# EAGLE design derploadxp (EAGLE 6.4)
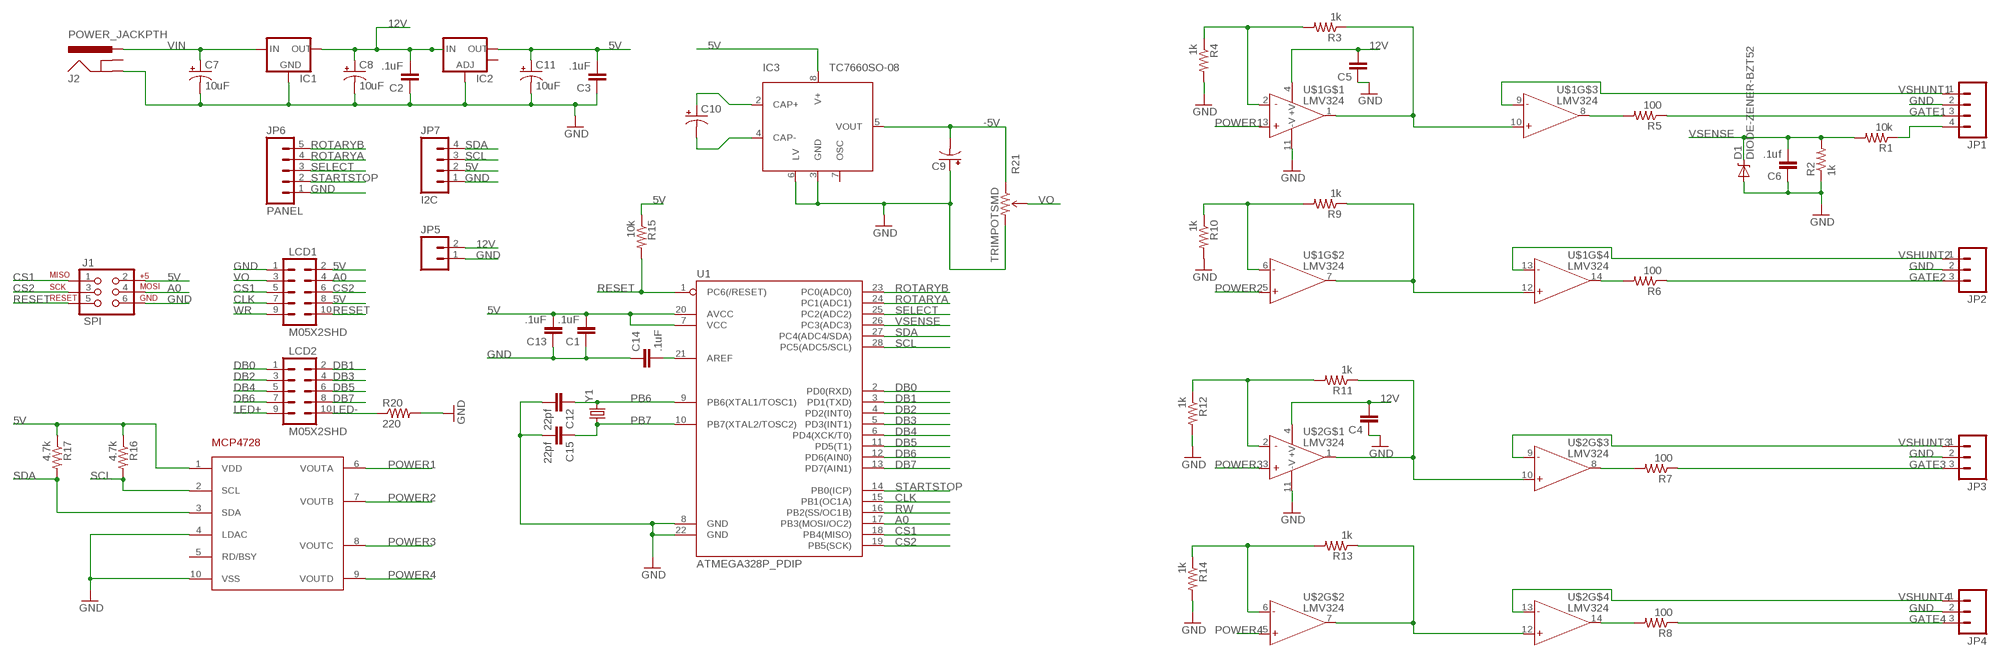
[diagram p0: schematic, sheet 1]

## Parts
C1  .1uF  CAP0805  [0805]
C2  .1uF  CAP0805  [0805]
C3  .1uF  CAP0805  [0805]
C4  CAP0805  [0805]
C5  CAP0805  [0805]
C6  .1uf  CAP0805  [0805]
C7  10uF  CAP_POLC  [PANASONIC_C]
C8  10uF  CAP_POLC  [PANASONIC_C]
C9  CAP_POLC  [PANASONIC_C]
C10  CAP_POLC  [PANASONIC_C]
C11  10uF  CAP_POLC  [PANASONIC_C]
C12  22pf  CAP0805  [0805]
C13  .1uF  CAP0805  [0805]
C14  .1uF  CAP0805  [0805]
C15  22pf  CAP0805  [0805]
D1  DIODE-ZENER-BZT52  [SOD-323]
IC1  V_REG_78XXSINK  [TO220-IGO]
IC2  V_REG_LM1117SOT223  [SOT223]
IC3  TC7660SO-08  [SO-08]
J1  SPI  AVR_SPI_PRG_6NS  [2X3-NS]
J2  POWER_JACKPTH  [POWER_JACK_PTH]
JP1  M04LOCK  [1X04_LOCK]
JP2  M03LOCK  [1X03_LOCK]
JP3  M03LOCK  [1X03_LOCK]
JP4  M03LOCK  [1X03_LOCK]
JP5  M02LOCK  [1X02_LOCK]
JP6  PANEL  M05LOCK  [1X05_LOCK]
JP7  I2C  M04LOCK  [1X04_LOCK]
LCD1  M05X2SHD  [2X5-SHROUDED]
LCD2  M05X2SHD  [2X5-SHROUDED]
R1  10k  RESISTOR0805-RES  [0805]
R2  1k  RESISTOR0805-RES  [0805]
R3  1k  RESISTOR0805-RES  [0805]
R4  1k  RESISTOR0805-RES  [0805]
R5  100  RESISTOR0805-RES  [0805]
R6  100  RESISTOR0805-RES  [0805]
R7  100  RESISTOR0805-RES  [0805]
R8  100  RESISTOR0805-RES  [0805]
R9  1k  RESISTOR0805-RES  [0805]
R10  1k  RESISTOR0805-RES  [0805]
R11  1k  RESISTOR0805-RES  [0805]
R12  1k  RESISTOR0805-RES  [0805]
R13  1k  RESISTOR0805-RES  [0805]
R14  1k  RESISTOR0805-RES  [0805]
R15  10k  RESISTOR0805-RES  [0805]
R16  4.7k  RESISTOR0805-RES  [0805]
R17  4.7k  RESISTOR0805-RES  [0805]
R20  220  RESISTOR0805-RES  [0805]
R21  TRIMPOTSMD  [TRIMPOT-3MM]
U1  ATMEGA328P_PDIP  [DIL28-3]
U$1  LMV324  [SO014]
U$2  LMV324  [SO014]
U$4  MCP4728  [MSOP10]
Y1  CRYSTALSMD  [HC49UP]

## Nets
5V: C1.2 C3.2 C11.+ C13.2 IC2.2(OUT) IC3.8(V+) J1.2 JP7.2 LCD1.2 LCD1.8 R15.1 R16.1 R17.1 U1.7(VCC) U1.20(AVCC) U$4.1(VDD)
12V: C2.2 C4.2 C5.2 C8.+ IC1.OUT IC2.3(IN) JP5.2 U$1.4(+V) U$2.4(+V)
-5V: C9.- IC3.5(VOUT) R21.1(CCW)
A0: J1.4 LCD1.4 U1.17(PB3(MOSI/OC2))
CLK: LCD1.7 U1.15(PB1(OC1A))
CS1: J1.1 LCD1.5 U1.18(PB4(MISO))
CS2: J1.3 LCD1.6 U1.19(PB5(SCK))
DB0: LCD2.1 U1.2(PD0(RXD))
DB1: LCD2.2 U1.3(PD1(TXD))
DB2: LCD2.3 U1.4(PD2(INT0))
DB3: LCD2.4 U1.5(PD3(INT1))
DB4: LCD2.5 U1.6(PD4(XCK/T0))
DB5: LCD2.6 U1.11(PD5(T1))
DB6: LCD2.7 U1.12(PD6(AIN0))
DB7: LCD2.8 U1.13(PD7(AIN1))
GATE1: JP1.3 R5.1
GATE2: JP2.3 R6.1
GATE3: JP3.3 R7.1
GATE4: JP4.3 R8.1
GND: C1.1 C2.1 C3.1 C4.1 C5.1 C6.1 C7.- C8.- C9.+ C11.- C12.2 C13.1 C14.1 C15.2 D1.2(A) IC1.GND IC2.1(ADJ) IC3.3(GND) IC3.6(LV) J1.6 J2.GND JP1.2 JP2.2 JP3.2 JP4.2 JP5.1 JP6.1 JP7.1 LCD1.1 R2.1 R4.2 R10.2 R12.2 R14.2 R20.2 R21.3(CW) U1.8(GND) U1.22(GND) U$1.11(-V) U$2.11(-V) U$4.4(LDAC) U$4.10(VSS)
LED+: LCD2.9
LED-: LCD2.10 R20.1
N$1: JP1.4 R1.1
N$2: C10.+ IC3.2(CAP+)
N$3: R5.2 U$1.8(OUT)
N$4: C10.- IC3.4(CAP-)
N$5: R3.1 U$1.1(OUT) U$1.10(+IN)
N$6: R9.2 R10.1 U$1.6(-IN)
N$7: R3.2 R4.1 U$1.2(-IN)
N$8: R6.2 U$1.14(OUT)
N$9: R8.2 U$2.14(OUT)
N$10: R7.2 U$2.8(OUT)
N$11: C14.2 U1.21(AREF)
N$12: R9.1 U$1.7(OUT) U$1.12(+IN)
N$15: R11.2 R12.1 U$2.2(-IN)
N$18: R13.2 R14.1 U$2.6(-IN)
N$19: R13.1 U$2.7(OUT) U$2.12(+IN)
N$20: R11.1 U$2.1(OUT) U$2.10(+IN)
PB6: C12.1 U1.9(PB6(XTAL1/TOSC1)) Y1.2
PB7: C15.1 U1.10(PB7(XTAL2/TOSC2)) Y1.1
POWER1: U$1.3(+IN) U$4.6(VOUTA)
POWER2: U$1.5(+IN) U$4.7(VOUTB)
POWER3: U$2.3(+IN) U$4.8(VOUTC)
POWER4: U$2.5(+IN) U$4.9(VOUTD)
RESET: J1.5 LCD1.10 R15.2 U1.1(PC6(/RESET))
ROTARYA: JP6.4 U1.24(PC1(ADC1))
ROTARYB: JP6.5 U1.23(PC0(ADC0))
RW: U1.16(PB2(SS/OC1B))
SCL: JP7.3 R16.2 U1.28(PC5(ADC5/SCL)) U$4.2(SCL)
SDA: JP7.4 R17.2 U1.27(PC4(ADC4/SDA)) U$4.3(SDA)
SELECT: JP6.3 U1.25(PC2(ADC2))
STARTSTOP: JP6.2 U1.14(PB0(ICP))
VIN: C7.+ IC1.IN J2.PWR
VO: LCD1.3 R21.2(WIPER)
VSENSE: C6.2 D1.1(C) R1.2 R2.2 U1.26(PC3(ADC3))
VSHUNT1: JP1.1 U$1.9(-IN)
VSHUNT2: JP2.1 U$1.13(-IN)
VSHUNT3: JP3.1 U$2.9(-IN)
VSHUNT4: JP4.1 U$2.13(-IN)
WR: LCD1.9
Unconnected: IC2.4(OUT) IC3.7(OSC) J2.GNDBREAK U$4.5(RD/BSY)

## Library data of the parts
C1-C6 C12-C15 = SparkFun-Passives:CAP: Capacitor Standard 0603 ceramic capacitor, and 0.1" leaded capacitor.
C7-C11 = SparkFun-Capacitors:CAP_POL: Capacitor Polarized These are standard SMD and PTH capacitors. Normally 10uF, 47uF, and 100uF in electrolytic and tantalum varieties. Always verify the external diameter of the through hole cap, it varies with capacity, voltage, and manufacturer. The EIA devices should be standard.
D1 = SparkFun-DiscreteSemi:DIODE-ZENER: Zener Diode Production Part - 8199 3.4V Zener Voltage
IC1 = SparkFun-PowerIC:V_REG_78XX: Voltage Regulator Standard 7805 5V regulator. IGO (Input Ground Output). Spark Fun Electronics SKU : COM-00107
IC2 = SparkFun-PowerIC:V_REG_LM1117: Voltage Regulator LM1117 Standard adjustable voltage regulator but in SMD form. Spark Fun Electronics SKU : COM-00595
IC3 = microchip_tc7660:TC7660: TC7660 Charge Pump DC-to-DC Voltage Converter
J1 = SparkFun-Connectors:AVR_SPI_PRG_6: AVR ISP 6 Pin This is the reduced ISP connector for AVR programming. Common on Arduino. This footprint will take up less PCB space and can be used with a 10-pin to 6-pin adapter such as SKU: BOB-08508
J2 = SparkFun-Connectors:POWER_JACK: Power Jack This is the standard 5.5mm barrel jack for power. The PTH is the most common, proven, reliable, footprint. The Slot footprint only works if the mill layer is transmitted to the PCB fab house so be warned. Spark Fun Electronics SKU : PRT-00119 SMT: CONN-08106 Mating wall wart : TOL-00298 (and others)
JP1 JP7 = SparkFun-Connectors:M04: Header 4 Standard 4-pin 0.1" header. Use with straight break away headers (SKU : PRT-00116), right angle break away headers (PRT-00553), swiss pins (PRT-00743), machine pins (PRT-00117), and female headers (PRT-00115). Molex polarized connector foot print use with SKU : PRT-08231 with associated crimp pins and housings. 1MM SMD Version SKU: PRT-10208
JP2-JP4 = SparkFun-Connectors:M03: Header 3 Standard 3-pin 0.1" header. Use with straight break away headers (SKU : PRT-00116), right angle break away headers (PRT-00553), swiss pins (PRT-00743), machine pins (PRT-00117), and female headers (PRT-00115). Molex polarized connector foot print use with SKU : PRT-08232 with associated crimp pins and housings.
JP5 = SparkFun-Connectors:M02: Header 2 Standard 2-pin 0.1" header. Use with straight break away headers (SKU : PRT-00116), right angle break away headers (PRT-00553), swiss pins (PRT-00743), machine pins (PRT-00117), and female headers (PRT-00115). Molex polarized connector foot print use with SKU : PRT-08233 with associated crimp pins and housings.
JP6 = SparkFun-Connectors:M05: Header 5 Standard 5-pin 0.1" header. Use with straight break away headers (SKU : PRT-00116), right angle break away headers (PRT-00553), swiss pins (PRT-00743), machine pins (PRT-00117), and female headers (PRT-00115). Molex polarized connector foot print use with SKU : PRT-08230 with associated crimp pins and housings.
LCD1 LCD2 = SparkFun-Connectors:M05X2: Header 5x2 Standard 10-pin dual row 0.1" header. Commonly used with AVR-ISP. Use with Spark Fun Electronics SKU: PRT-00778
R1-R17 R20 = SparkFun-Passives:RESISTOR: Resistor Basic schematic elements and footprints for 0603, 1206, and PTH resistors.
R21 = SparkFun-Electromechanical:TRIMPOT: Various small potentiometers for "set-and-forget" applications
U1 = SparkFun-DigitalIC:ATMEGA328P_PDIP: uC used in the Arduino 32kb flash, 1k EEPROM, 2k SRAM This is the through-hole version of this chip.
U$1 U$2 = SparkFun-AnalogIC:LMV324: Jellybean quad op-amp; PROD_ID: IC-08227
U$4 = mcp4728:MCP4728
Y1 = SparkFun-FreqCtrl:CRYSTAL: Various standard crystals. Proven footprints. Spark Fun Electronics SKU : COM-00534

## Board
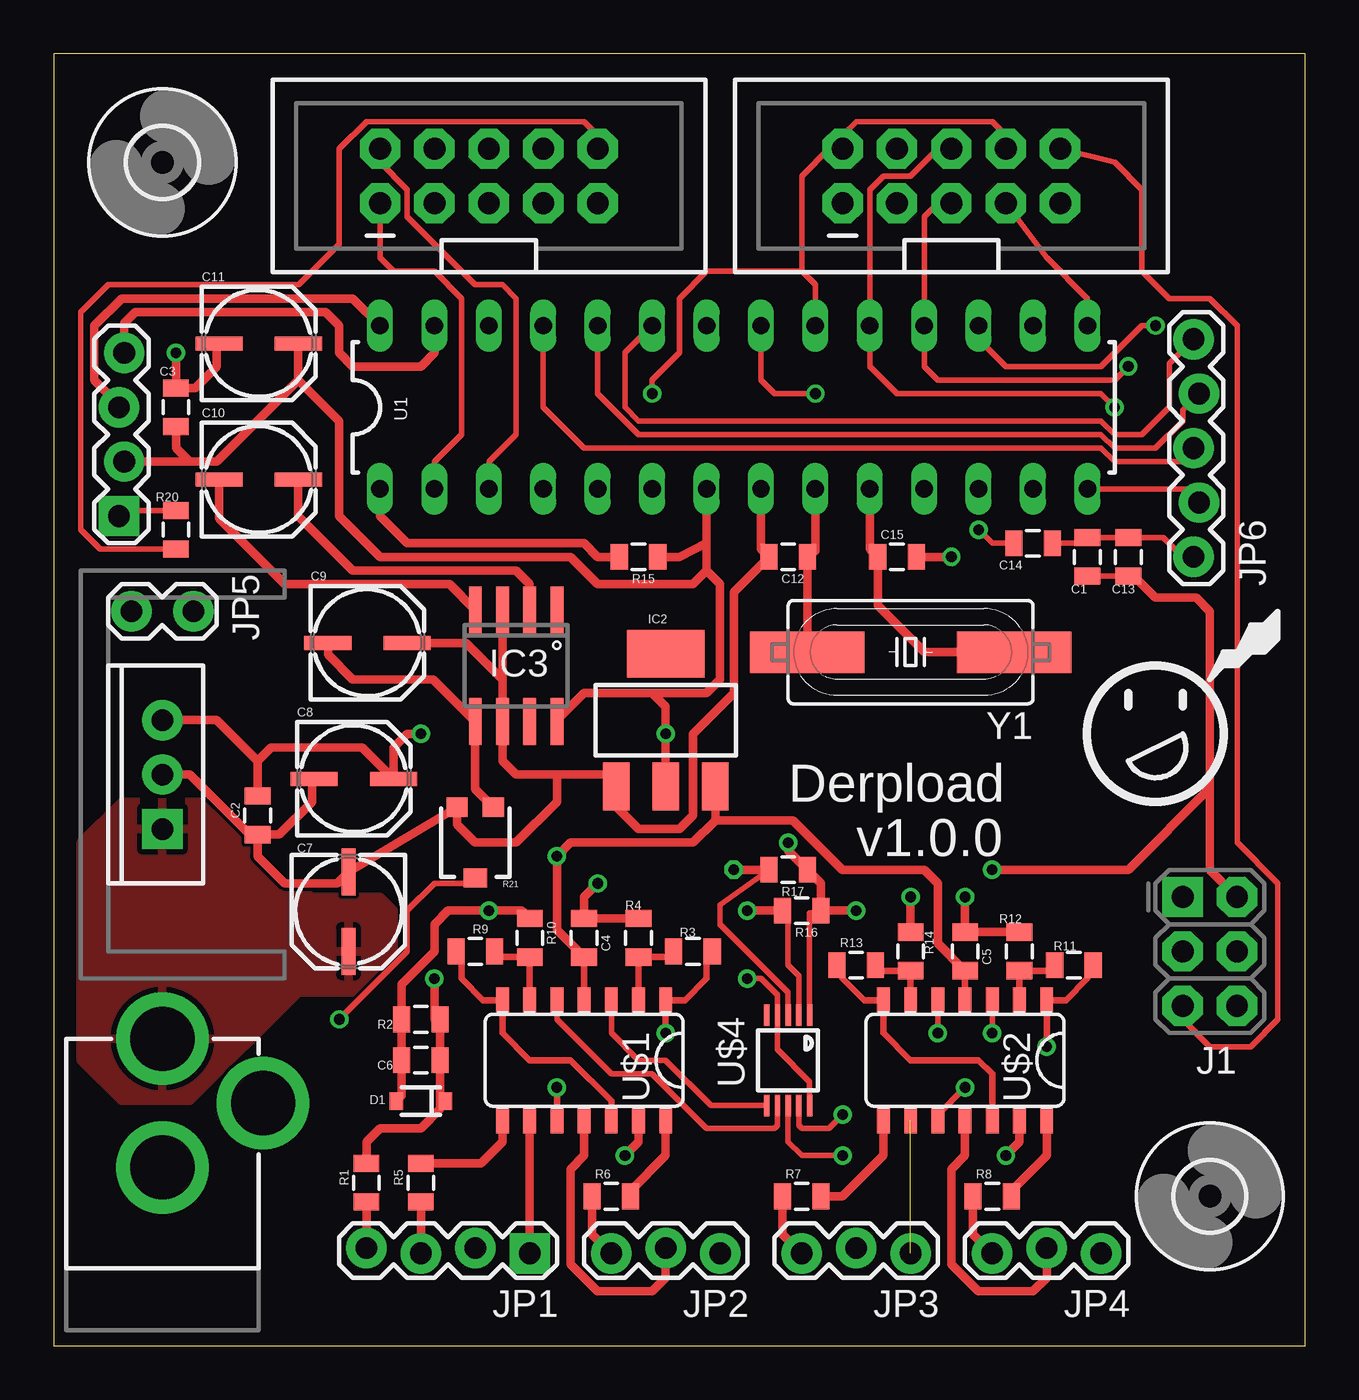
[diagram p1: board, top side]
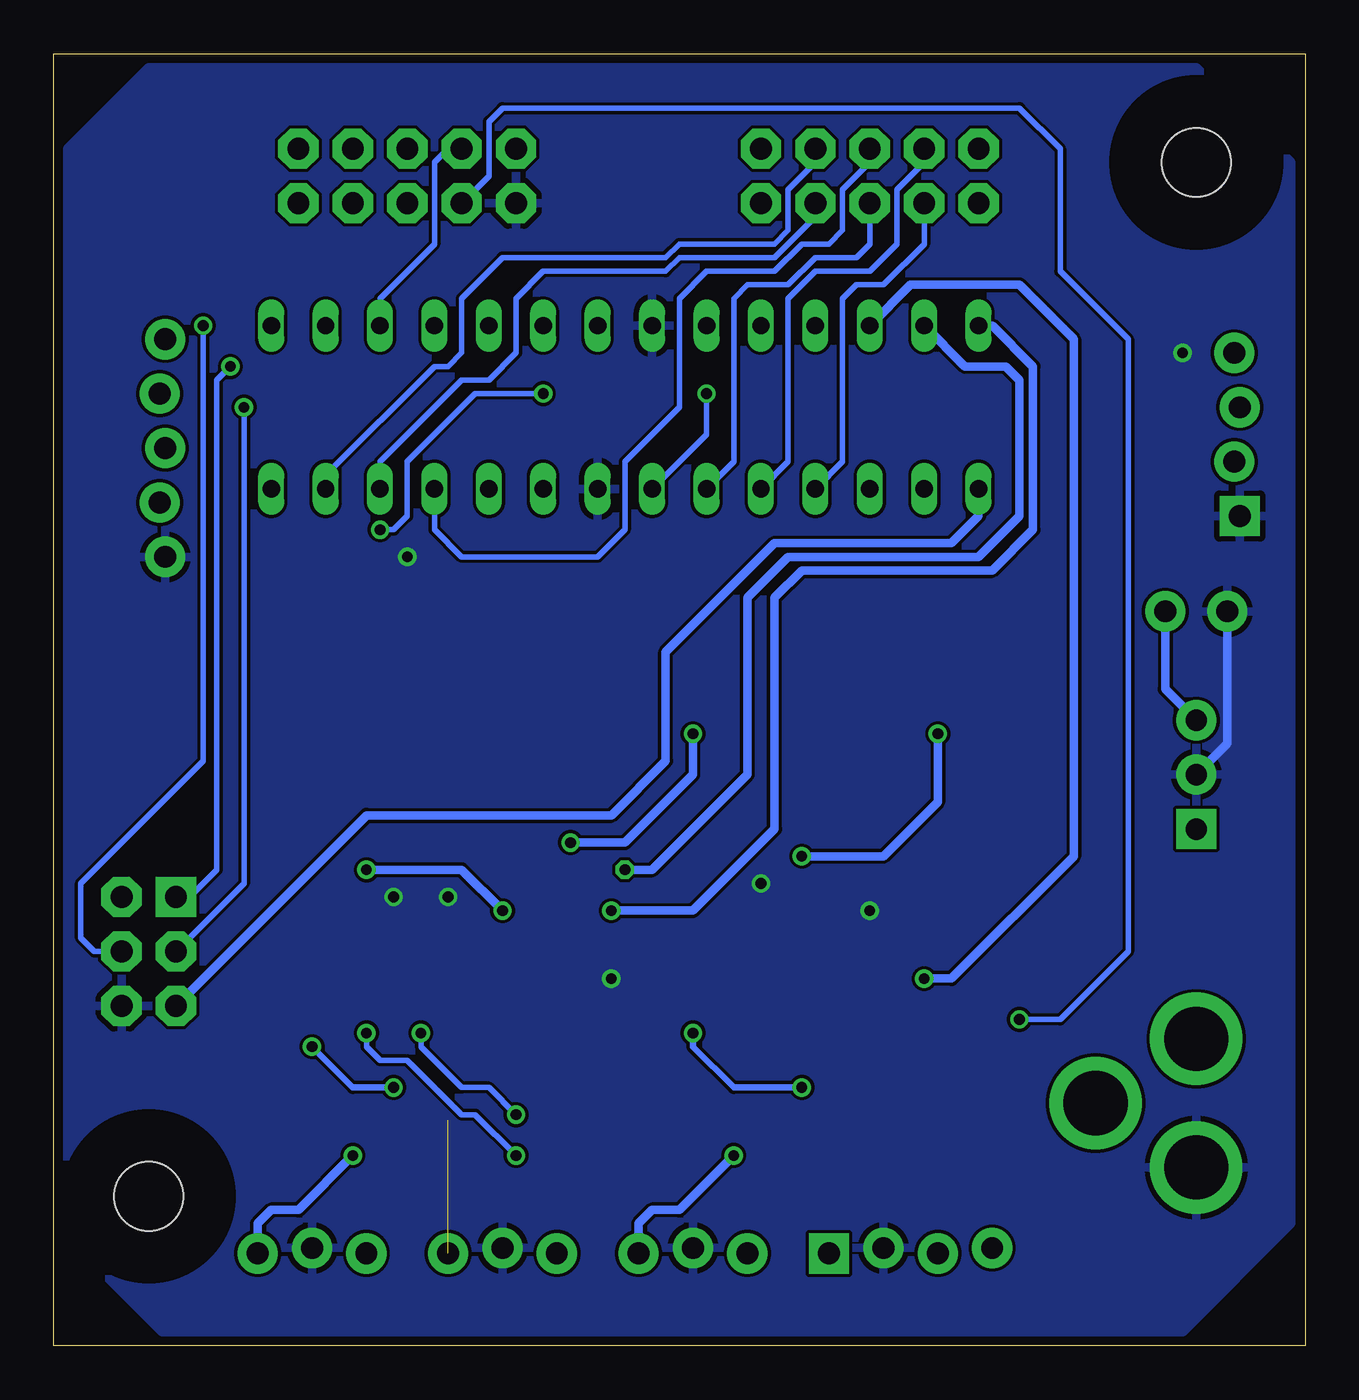
[diagram p2: board, bottom side, seen from below]

Size 58.42 x 60.33 mm. Coordinates in mm from the lower left corner, seen from the top.
Outline: 0,0 58.42,0 58.42,60.33 0,60.33 0,0
Copper layers (1*16): Top 0.0356mm / dielectric 1.5011mm / Bottom 0.0356mm
Design rules "oshpark": minimum track width 6mil, minimum drill 13mil, track to track 6mil, track to pad 6mil, pad to pad 6mil, via to via 6mil, smd to smd 6mil, copper to edge 15mil, drill to drill 6mil, minimum pad ring 7mil, minimum via ring 7mil, stop-mask expansion 3mil, vias tented up to drill 0mil, thermal gap 10mil

### Footprints (pad centres in the part's own frame; a part is rotated, then mirrored left to right if it is on the bottom)
0805 = smd 0.8 x 1.2: 1 -0.9,0; 2 0.9,0
PANASONIC_C = smd 2.2 x 0.65: + 1.9,-0.2; - -1.8,-0.2
SOD-323 = smd 0.63 x 0.83: 1 -1.15,0; 2 1.15,0
TO220-IGO = drill 1 pad 1.88: GND 0,0; OUT 2.54,0 | drill 1 pad 1.88 square: IN -2.54,0
SOT223 = smd 1.219 x 2.235: 1 -2.311,-3.099; 2 0,-3.099; 3 2.311,-3.099 | smd 3.6 x 2.2: 4 0,3.099
SO-08 = smd 0.6 x 2.2: 1 -1.905,-2.6; 2 -0.635,-2.6; 3 0.635,-2.6; 4 1.905,-2.6; 5 1.905,2.6; 6 0.635,2.6; 7 -0.635,2.6; 8 -1.905,2.6
2X3-NS = drill 1.016 pad 1.88 square: 1 -2.54,-1.27 | drill 1.016 pad 1.88 octagon: 2 -2.54,1.27; 3 0,-1.27; 4 0,1.27; 5 2.54,-1.27; 6 2.54,1.27
POWER_JACK_PTH = drill 2.997 pad 4.318: GND 0,7.7; GNDBREAK 4.7,10.7; PWR 0,13.7
1X04_LOCK = drill 1.016 pad 1.88 square: 1 0,0.127 | drill 1.016 pad 1.88: 2 2.54,-0.127; 3 5.08,0.127; 4 7.62,-0.127
1X03_LOCK = drill 1.016 pad 1.88: 1 0,0.127; 2 2.54,-0.127; 3 5.08,0.127
1X02_LOCK = drill 1.016 pad 1.88: 1 -0.178,0; 2 2.718,0
1X05_LOCK = drill 1.016 pad 1.88: 1 0,0.127; 2 2.54,-0.127; 3 5.08,0.127; 4 7.62,-0.127; 5 10.16,0.127
2X5-SHROUDED = drill 1.016 pad 1.88 octagon: 1 -1.27,5.08; 2 1.27,5.08; 3 -1.27,2.54; 4 1.27,2.54; 5 -1.27,0; 6 1.27,0; 7 -1.27,-2.54; 8 1.27,-2.54; 9 -1.27,-5.08; 10 1.27,-5.08
TRIMPOT-3MM = smd 1 x 0.9: 1 -0.85,-1.65; 3 0.85,-1.65 | smd 1.1 x 0.9: 2 0,1.65
DIL28-3 = drill 0.813 long: 1 -16.51,-3.81; 2 -13.97,-3.81; 3 -11.43,-3.81; 4 -8.89,-3.81; 5 -6.35,-3.81; 6 -3.81,-3.81; 7 -1.27,-3.81; 8 1.27,-3.81; 9 3.81,-3.81; 10 6.35,-3.81; 11 8.89,-3.81; 12 11.43,-3.81; 13 13.97,-3.81; 14 16.51,-3.81; 15 16.51,3.81; 16 13.97,3.81; 17 11.43,3.81; 18 8.89,3.81; 19 6.35,3.81; 20 3.81,3.81; 21 1.27,3.81; 22 -1.27,3.81; 23 -3.81,3.81; 24 -6.35,3.81; 25 -8.89,3.81; 26 -11.43,3.81; 27 -13.97,3.81; 28 -16.51,3.81
SO014 = smd 0.6 x 1.2: 1 -3.175,-2.8; 2 -1.905,-2.8; 3 -0.635,-2.8; 4 0.635,-2.8; 5 1.905,-2.8; 6 3.175,-2.8; 7 4.445,-2.8; 8 4.445,2.8; 9 3.175,2.8; 10 1.905,2.8; 11 0.635,2.8; 12 -0.635,2.8; 13 -1.905,2.8; 14 -3.175,2.8
MSOP10 = smd 0.25 x 1: 1 -1,-2.113; 2 -0.5,-2.113; 3 0,-2.113; 4 0.5,-2.113; 5 1,-2.113; 6 1,2.113; 7 0.5,2.113; 8 0,2.113; 9 -0.5,2.113; 10 -1,2.113
3,2 = hole 3.2: 0,0
HC49UP = smd 5.334 x 1.93: 1 -4.826,0; 2 4.826,0

### Placement (x,y rotation side)
C1  48.26,36.83 270 top
C2  9.53,24.77 90 top
C3  5.71,43.81 270 top
C4  24.77,19.05 270 top
C5  42.55,18.41 270 top
C6  17.14,13.34 0 top
C7  13.97,20.32 270 top
C8  13.97,26.67 0 top
C9  14.61,33.02 0 top
C10  9.53,40.64 0 top
C11  9.53,46.99 0 top
C12  34.29,36.83 180 top
C13  50.16,36.83 270 top
C14  45.72,37.47 180 top
C15  39.37,36.83 0 top
D1  17.14,11.43 180 top
IC1  5.08,26.67 90 top
IC2  28.57,29.21 0 top
IC3  21.59,31.75 180 top
J1  53.98,18.41 270 top
J2  5.08,0.64 0 top
JP1  22.23,4.45 180 top
JP2  31.11,4.45 180 top
JP3  40.01,4.45 180 top
JP4  48.9,4.45 180 top
JP5  3.81,34.29 0 top
JP6  53.34,36.83 90 top
JP7  3.17,38.73 90 top
LCD1  41.91,54.61 90 top
LCD2  20.32,54.61 90 top
R1  14.61,7.62 90 top
R2  17.14,15.24 0 top
R3  29.84,18.41 180 top
R4  27.3,19.05 90 top
R5  17.14,7.62 90 top
R6  26.04,6.99 0 top
R7  34.92,6.99 0 top
R8  43.81,6.99 0 top
R9  19.68,18.41 0 top
R10  22.23,19.05 90 top
R11  47.62,17.78 180 top
R12  45.09,18.41 90 top
R13  37.47,17.78 0 top
R14  40.01,18.41 90 top
R15  27.3,36.83 180 top
R16  34.92,20.32 180 top
R17  34.29,22.23 180 top
R20  5.71,38.1 90 top
R21  19.68,23.5 180 top
U1  31.75,43.81 0 top
U$1  25.4,13.34 180 top
U$2  43.18,13.34 180 top
U$4  34.29,13.34 180 top
U$5  [3,2]  53.98,6.99 0 top
U$7  [3,2]  5.08,55.24 0 top
Y1  40.01,32.38 180 top

### Tracks (layer width: path | path; a pad name or v marks a point on that pad's centre or on a via)
5V  (via drill 0.5, 0.5 pad 0.25)
  Top 0.254: U$4.1 35.29,20.22 R16.1 | v27.94,44.45 27.94,45.09 29.21,46.35 29.21,48.9 30.48,50.16 34.92,50.16 | U1.20 35.56,49.53 34.92,50.16 | 34.92,50.16 34.92,54.61 36.2,55.88 LCD1.2 36.83,56.52 37.47,57.15 43.81,57.15 44.45,56.52 LCD1.8 | C1.2 C13.2
  Top 0.406: v37.47,20.32 R16.1 35.83,21.59 R17.1 34.29,23.12 v34.29,23.5 | v43.81,22.23 50.16,22.23 53.98,26.04 | IC2.2 v28.57,28.57 28.57,29.84 27.94,30.48 | IC3.8 23.5,29.21 24.77,30.48 27.94,30.48 | 30.48,36.2 30.48,37.47 | 30.48,37.47 U1.7 | 27.94,30.48 30.48,30.48 31.11,31.11 31.11,35.56 30.48,36.2 | 30.48,37.47 29.21,36.83 R15.1 | C13.2 50.43,35.93 51.44,34.92 53.34,34.92 53.98,34.29 53.98,26.04 | 53.98,26.04 53.98,22.23 J1.2 | C11.+ 11.43,45.09 | 11.43,45.09 13.34,43.18 13.34,38.73 15.24,36.83 24.13,36.83 25.4,35.56 29.84,35.56 30.48,36.2 | JP7.2 6.35,41.27 | 6.35,41.27 7.61,41.27 11.43,45.09 | C3.2 5.71,41.91 6.35,41.27
  Bottom 0.254: U1.7 27.94,42.55 v27.94,44.45
  Bottom 0.406: v37.47,20.32 39.37,22.23 v43.81,22.23 | v34.29,23.5 31.75,23.5 28.57,26.67 v28.57,28.57
12V  (via drill 0.5 pad 0.25)
  Top 0.305: C5.2 U$2.4 | C4.2 U$1.4
  Top 0.406: v17.14,28.57 16.51,28.57 15.87,27.95 C8.+ 14.4,27.94 10.16,27.94 9.53,27.3 | IC2.3 30.89,24.54 | 30.89,24.54 29.84,23.5 24.13,23.5 v23.5,22.86 23.5,19.42 C4.2 | 30.89,24.54 34.52,24.54 36.83,22.23 40.64,22.23 41.27,21.59 41.27,18.79 C5.2 | 9.53,27.3 7.62,29.21 IC1.OUT | C2.2 9.53,27.3
  Bottom 0.406: v17.14,28.57 17.14,25.4 19.68,22.86 v23.5,22.86 | JP5.2 6.53,30.66 IC1.OUT
-5V
  Top 0.406: R21.1 19.68,26 IC3.5 17.72,31.11 13.97,31.11 12.8,32.28 C9.-
A0  (via drill 0.5)
  Top 0.254: U1.17 43.18,46.99 44.45,45.72 48.9,45.72 50.8,47.62 v51.44,47.62
  Bottom 0.254: v51.44,47.62 51.44,27.3 57.15,21.59 57.15,19.05 56.52,18.41 J1.4 | LCD1.4 40.01,55.88 40.64,55.24 40.64,51.44 43.18,48.9 U1.17
CLK
  Top 0.254: LCD1.7 46.35,50.8 48.26,48.9 U1.15
CS1  (via drill 0.5)
  Top 0.254: v50.16,45.72 49.53,45.09 41.27,45.09 40.64,45.72 U1.18 40.64,52.7 41.27,53.34 LCD1.5
  Bottom 0.254: v50.16,45.72 50.8,45.09 50.8,22.23 52.07,20.95 J1.1
CS2  (via drill 0.5)
  Top 0.254: v49.53,43.81 48.9,44.45 39.37,44.45 38.1,45.72 U1.19 38.1,53.98 38.73,54.61 40.01,54.61 41.27,55.88 LCD1.6
  Bottom 0.254: v49.53,43.81 49.53,21.59 J1.3
DB0
  Top 0.254: U1.2 17.78,41.27 19.05,42.55 19.05,48.9 17.78,50.16 15.88,50.16 15.24,50.8 LCD2.1
DB1
  Top 0.254: U1.3 20.32,41.27 21.59,42.55 21.59,48.9 20.95,49.53 19.68,49.53 16.51,52.7 16.51,53.98 15.24,55.24 LCD2.2
DB2
  Bottom 0.254: U1.4 21.59,41.27 21.59,48.9 20.95,49.53 19.68,49.53 17.78,51.44 LCD2.3
DB3
  Bottom 0.254: LCD2.4 17.78,55.24 19.05,53.98 19.05,51.44 20.32,50.16 22.86,50.16 24.13,48.9 24.13,41.27 U1.5
DB4
  Bottom 0.254: LCD2.5 20.32,51.44 20.95,50.8 22.86,50.8 24.13,49.53 26.04,49.53 26.67,48.9 26.67,41.27 U1.6
DB5
  Bottom 0.254: LCD2.6 20.32,55.24 21.59,53.98 21.59,52.07 22.23,51.44 23.5,51.44 24.77,50.16 27.94,50.16 29.21,48.9 29.21,43.81 31.75,41.27 31.75,38.1 33.02,36.83 39.37,36.83 40.64,38.1 U1.11
DB6
  Bottom 0.254: LCD2.7 22.86,52.7 24.77,50.8 29.21,50.8 29.84,50.16 35.56,50.16 36.83,48.9 36.83,46.35 38.1,45.09 39.37,45.09 43.18,41.27 U1.12
DB7
  Bottom 0.254: LCD2.8 22.86,55.24 24.13,53.98 24.13,52.07 24.77,51.44 29.21,51.44 29.84,50.8 37.47,50.8 39.37,48.9 39.37,46.35 40.01,45.72 40.64,45.72 45.72,40.64 U1.13
GATE1
  Top 0.406: R5.1 JP1.3
GATE2
  Top 0.406: R6.1 25.14,5.22 JP2.3
GATE3
  Top 0.406: R7.1 34.02,5.22 JP3.3
GATE4
  Top 0.406: R8.1 42.91,5.22 JP4.3
GND  (via drill 0.5, 0.5 pad 0.25)
  Top 0.254: U$4.10 35.29,12.34 33.79,13.84 U$4.4 33.79,16.38 33.02,17.14 v32.38,17.14 | C14.1 47.99,37.47 C1.1 C13.1 51.8,37.73 52.7,36.83 JP6.1 | R20.2 3.31,39 JP7.1
  Top 0.406: C15.2 v41.91,36.83 | R4.2 C4.1 24.77,20.95 v25.4,21.59 | v42.55,20.95 C5.1 R12.2 | R14.2 v40.01,20.95 | U1.8 33.02,37.2 C12.2 31.75,35.19 31.75,30.48 29.84,28.57 29.84,24.77 29.21,24.13 27.3,24.13 26.26,25.17 IC2.1 26.26,26.67 23.5,26.67 | IC3.3 20.95,31.11 | 20.95,31.11 IC3.6 20.95,27.3 21.59,26.67 23.5,26.67 | C2.1 9.15,23.86 6.35,26.67 IC1.GND | C2.1 9.53,22.86 10.79,21.59 13.24,21.59 C7.- 18.05,24.66 R21.3 18.84,24.34 19.68,23.5 21.59,23.5 23.5,25.4 23.5,26.67 | C2.1 10.53,23.86 12.06,25.4 12.06,26.36 C8.- | C9.+ 19.25,32.82 20.95,31.11 | R10.2 21.86,20.32 v20.32,20.32 18.41,20.32 17.78,19.68 17.78,18.41 16.25,16.88 R2.1 C6.1 16.25,11.68 D1.2 | C11.- 7.62,46.69 7.62,45.72 6.62,44.72 C3.1 v5.71,46.35 | U$1.11 24.77,8.89 24.13,8.26 24.13,3.81 25.4,2.54 27.94,2.54 28.57,3.17 JP2.2 | U$2.11 42.55,8.89 41.91,8.26 41.91,3.81 43.18,2.54 45.72,2.54 46.35,3.17 JP4.2
  Bottom 0.406: JP5.1 3.63,28.12 IC1.GND
  pour Bottom: 5.71,0.64 53.34,0.64 57.78,5.08 57.78,55.88 53.98,59.69 5.08,59.69 0.64,55.24 0.64,5.71
LED-
  Top 0.254: R20.1 2.17,37.2 1.27,38.1 1.27,48.26 2.54,49.53 11.43,49.53 13.34,51.44 13.34,55.88 14.61,57.15 24.77,57.15 25.4,56.52 LCD2.10
N$1
  Top 0.406: R1.1 JP1.4
N$2
  Top 0.406: C10.+ 11.43,38.74 13.97,36.2 21.59,36.2 22.23,35.56 IC3.2
N$3
  Top 0.406: R5.2 19.95,8.52 20.95,9.53 U$1.8
N$4
  Top 0.406: C10.- 7.72,38.63 10.79,35.56 18.48,35.56 IC3.4
N$5  (via drill 0.5 pad 0.25)
  Top 0.305: R3.1 30.48,18.15 30.48,17.14 29.47,16.14 U$1.1 v28.57,14.61 | U$1.10 v23.5,12.06
  Bottom 0.305: v23.5,12.06 26.67,12.06 28.57,13.97 v28.57,14.61
N$6
  Top 0.305: U$1.6 R10.1 20.85,18.15 R9.2
N$7
  Top 0.305: U$1.2 R4.1 28.68,18.15 R3.2
N$8
  Top 0.406: R6.2 26.93,7.25 28.57,8.89 U$1.14
N$9
  Top 0.406: R8.2 44.72,7.25 46.35,8.89 U$2.14
N$10
  Top 0.406: R7.2 36.83,6.99 38.73,8.89 U$2.8
N$11  (via drill 0.5 pad 0.25)
  Top 0.254: U1.21 33.02,45.09 33.66,44.45 v35.56,44.45 | v43.18,38.1 43.81,37.47 C14.2
  Bottom 0.254: v35.56,44.45 38.73,44.45 41.91,41.27 41.91,38.73 42.55,38.1 v43.18,38.1
N$12
  Top 0.305: R9.1 19.05,18.15 19.05,17.14 20.06,16.14 U$1.7 20.95,14.61 22.23,13.34 24.13,13.34 26.04,11.43 U$1.12
N$15
  Top 0.305: U$2.2 R12.1 46.46,17.52 R11.2
N$18
  Top 0.305: R13.2 38.63,17.52 R14.1 U$2.6
N$19
  Top 0.305: R13.1 36.83,18.15 36.83,17.14 37.84,16.14 U$2.7 38.73,14.61 40.01,13.34 43.18,13.34 43.81,12.7 U$2.12
N$20  (via drill 0.5 pad 0.25)
  Top 0.305: R11.1 48.26,18.15 48.26,17.14 47.25,16.14 U$2.1 v46.35,13.97 | U$2.10 41.27,10.79 v42.55,12.06
  Bottom 0.305: v42.55,12.06 44.45,12.06 v46.35,13.97
PB6
  Top 0.406: U1.9 35.56,37.09 C12.1 35.19,32.4 Y1.2
PB7
  Top 0.406: U1.10 38.1,37.2 C15.1 38.47,34.55 40.64,32.38 Y1.1
POWER1
  Top 0.254: U$4.6 30.69,11.22 28.57,13.34 27.3,13.34 26.04,14.61 U$1.3
POWER2
  Top 0.254: U$4.7 33.79,10.29 33.66,10.16 30.48,10.16 27.94,12.7 26.04,12.7 23.5,15.24 U$1.5
POWER3  (via drill 0.5)
  Top 0.254: U$4.8 34.29,9.53 34.92,8.89 v36.83,8.89 | v43.81,14.61 U$2.3
  Bottom 0.254: v36.83,8.89 38.73,10.79 39.37,10.79 41.91,13.34 43.18,13.34 43.81,13.97 v43.81,14.61
POWER4  (via drill 0.5, 0.5 pad 0.25)
  Top 0.254: U$4.9 34.79,10.29 34.92,10.16 36.2,10.16 v36.83,10.79 | v41.27,14.61 U$2.5
  Bottom 0.254: v36.83,10.79 38.1,12.06 39.37,12.06 41.27,13.97 v41.27,14.61
RESET
  Top 0.254: LCD1.10 49.53,55.24 50.8,53.98 50.8,50.16 52.07,48.9 53.98,48.9 55.24,47.62 55.24,23.5 57.15,21.59 57.15,15.24 55.88,13.97 53.98,13.97 52.7,15.24 J1.5
  Top 0.406: R15.2 25.4,36.83 24.77,37.47 16.51,37.47 15.24,38.73 U1.1
  Bottom 0.406: J1.5 43.81,24.77 32.38,24.77 29.84,27.3 29.84,32.38 24.77,37.47 16.51,37.47 15.24,38.73 U1.1
ROTARYA
  Top 0.254: U1.24 25.4,44.45 27.3,42.55 48.9,42.55 49.53,41.91 51.44,41.91 52.7,43.18 52.7,43.69 JP6.4
ROTARYB
  Top 0.254: U1.23 26.67,46.35 26.67,43.81 27.3,43.18 48.9,43.18 49.53,42.55 50.8,42.55 52.07,43.81 52.07,45.85 JP6.5
SCL  (via drill 0.5)
  Top 0.254: U$4.2 34.79,17.28 34.29,17.78 34.29,20.05 R16.2
  Top 0.406: R16.2 v32.38,20.32 | JP7.3 3.05,43.94 1.91,45.09 1.91,47.62 3.17,48.9 13.97,48.9 U1.28
  Bottom 0.406: v32.38,20.32 28.57,20.32 24.77,24.13 24.77,34.92 23.5,36.2 14.61,36.2 12.7,38.1 12.7,45.72 14.61,47.62 U1.28
SDA  (via drill 0.5 pad 0.25)
  Top 0.254: U$4.3 34.29,16.51 31.11,19.68 31.11,20.59 R17.2
  Top 0.406: R17.2 v31.75,22.23 | JP7.4 3.3,47.75 3.81,48.26 12.7,48.26 13.34,47.62 13.34,46.35 13.97,45.72 17.14,45.72 17.78,46.35 U1.27
  Bottom 0.406: v31.75,22.23 30.48,22.23 26.04,26.67 26.04,34.92 24.13,36.83 15.24,36.83 13.34,38.73 13.34,45.09 13.97,45.72 15.88,45.72 U1.27
SELECT
  Top 0.254: U1.25 22.86,43.81 24.77,41.91 48.9,41.91 49.53,41.27 52.58,41.27 JP6.3
STARTSTOP
  Top 0.254: U1.14 52.83,40.01 JP6.2
VIN
  pour Top: 6.35,11.43 3.17,11.43 1.27,13.34 1.27,23.5 3.17,25.4 6.99,25.4 12.06,20.95 15.24,20.95 15.88,20.32 15.88,18.41 13.97,16.51 11.43,16.51
VO  (via drill 0.5)
  Top 0.254: v13.34,15.24 16.51,18.41 16.51,20.32 17.78,21.59 19.68,21.59 R21.2
  Bottom 0.254: LCD1.3 38.1,54.61 38.1,57.15 37.47,57.78 13.34,57.78 11.43,55.88 11.43,50.16 8.26,46.99 8.26,18.41 11.43,15.24 v13.34,15.24
VSENSE  (via drill 0.5)
  Top 0.406: v17.78,17.14 17.78,15.24 R2.2 C6.2 18.05,11.68 | 18.05,11.68 D1.1 | 18.05,11.68 18.05,11.06 17.14,10.16 15.24,10.16 14.61,9.53 R1.2
  Bottom 0.406: U1.26 18.41,49.53 13.34,49.53 10.79,46.99 10.79,22.86 16.51,17.14 v17.78,17.14
VSHUNT1
  Top 0.406: U$1.9 JP1.1
VSHUNT2  (via drill 0.5)
  Top 0.406: U$1.13 27.3,9.53 v26.67,8.89
  Bottom 0.406: v26.67,8.89 29.21,6.35 30.48,6.35 31.11,5.71 JP2.1
VSHUNT3  (1 unrouted)
VSHUNT4  (via drill 0.5)
  Top 0.406: U$2.13 45.09,9.53 v44.45,8.89
  Bottom 0.406: v44.45,8.89 46.99,6.35 48.26,6.35 48.9,5.71 JP4.1

### Text on the board
tNames: Derpload | v1.0.0